# Altium schematic sheet SH2 - HBridge.SchDoc
size Letter
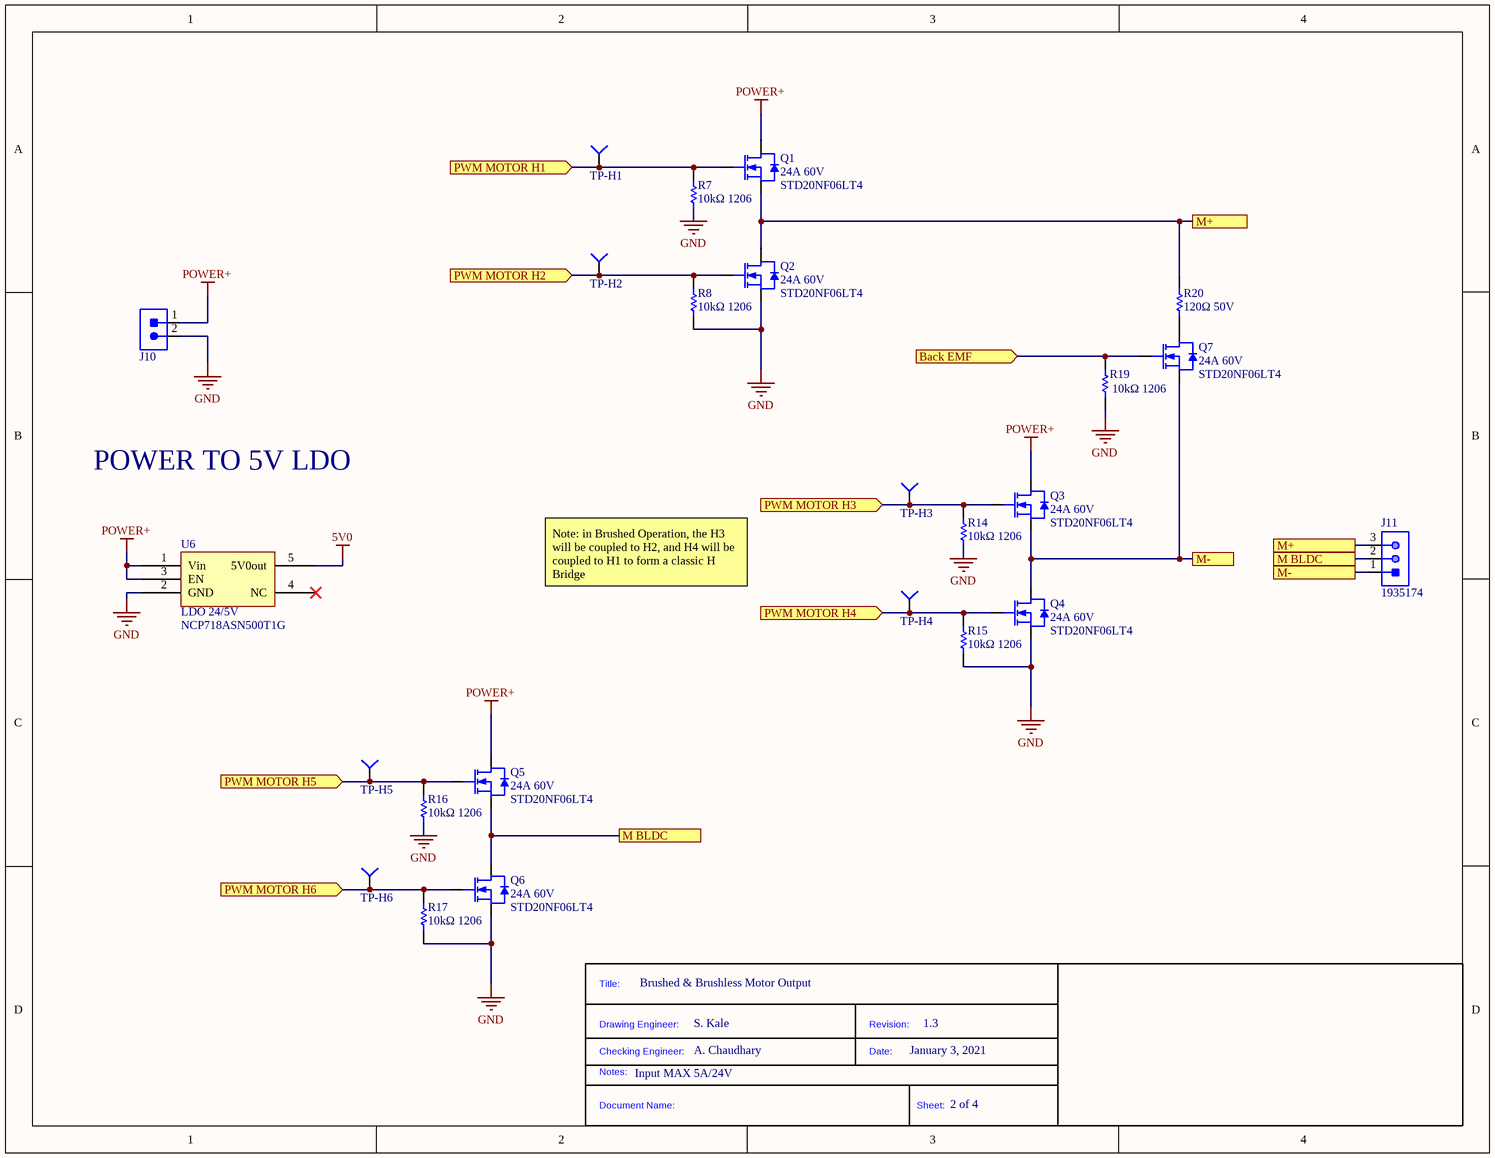
[diagram p0: SH2 - HBridge.SchDoc]

## Parts
*?  HORNET LOGO  (value not drawn)  (graphical)
?  TitleBlock  (value not drawn)  (graphical)
J10  CON 2-SCREW  [1935161]  (value not drawn)
J11  CON 3-SCREW  [1935174]  (value not drawn)
Q1  24A 60V  [STD20NF06LT4]
Q2  24A 60V  [STD20NF06LT4]
Q3  24A 60V  [STD20NF06LT4]
Q4  24A 60V  [STD20NF06LT4]
Q5  24A 60V  [STD20NF06LT4]
Q6  24A 60V  [STD20NF06LT4]
Q7  24A 60V  [STD20NF06LT4]
R7  10kΩ 1206  [13-RE1206FRE0710KLCT-ND]
R8  10kΩ 1206  [13-RE1206FRE0710KLCT-ND]
R14  10kΩ 1206  [13-RE1206FRE0710KLCT-ND]
R15  10kΩ 1206  [13-RE1206FRE0710KLCT-ND]
R16  10kΩ 1206  [13-RE1206FRE0710KLCT-ND]
R17  10kΩ 1206  [13-RE1206FRE0710KLCT-ND]
R19  10kΩ 1206  [13-RE1206FRE0710KLCT-ND]
R20  120Ω 50V  [SDR03EZPJ200]
TP-H1  TESTPT  [TESTPT SQUARE]  (value not drawn)
TP-H2  TESTPT  [TESTPT SQUARE]  (value not drawn)
TP-H3  TESTPT  [TESTPT SQUARE]  (value not drawn)
TP-H4  TESTPT  [TESTPT SQUARE]  (value not drawn)
TP-H5  TESTPT  [TESTPT SQUARE]  (value not drawn)
TP-H6  TESTPT  [TESTPT SQUARE]  (value not drawn)
U6  LDO 24/5V  [NCP718ASN500T1G]

## Ports
Back EMF (in), M BLDC, M+, M-, PWM MOTOR H1 (in), PWM MOTOR H2 (in), PWM MOTOR H3 (in), PWM MOTOR H4 (in), PWM MOTOR H5 (in), PWM MOTOR H6 (in)

## Nets
5V0: U6.5(5V0out)
GND: J10.2 Q2.3(Source) Q4.3(Source) Q6.3(Source) R7.1 R8.1 R14.1 R15.1 R16.1 R17.1 R19.1 U6.2(GND)
POWER+: J10.1 Q1.2(Drain) Q3.2(Drain) Q5.2(Drain) U6.1(Vin) U6.3(EN)
Back EMF: Q7.1(Gate) R19.2 ; port Back EMF
M BLDC: J11.2 Q5.3(Source) Q6.2(Drain) ; port M BLDC
M+: J11.3 Q1.3(Source) Q2.2(Drain) R20.2 ; port M+
M-: J11.1 Q3.3(Source) Q4.2(Drain) Q7.3(Source) ; port M-
PWM MOTOR H1: Q1.1(Gate) R7.2 TP-H1.1(=value) ; port PWM MOTOR H1
PWM MOTOR H2: Q2.1(Gate) R8.2 TP-H2.1(=value) ; port PWM MOTOR H2
PWM MOTOR H3: Q3.1(Gate) R14.2 TP-H3.1(=value) ; port PWM MOTOR H3
PWM MOTOR H4: Q4.1(Gate) R15.2 TP-H4.1(=value) ; port PWM MOTOR H4
PWM MOTOR H5: Q5.1(Gate) R16.2 TP-H5.1(=value) ; port PWM MOTOR H5
PWM MOTOR H6: Q6.1(Gate) R17.2 TP-H6.1(=value) ; port PWM MOTOR H6
NetQ7_2: Q7.2(Drain) R20.1

Not connected (* = marked no-connect by the designer): U6 4(NC)*

## Notes on the sheet
- POWER TO 5V LDO
- Note: in Brushed Operation, the H3 will be coupled to H2, and H4 will be coupled to H1 to form a classic H Bridge
- Brushed & Brushless Motor Output
- S. Kale
- 1.3
- Input MAX 5A/24V
- A. Chaudhary
- January 3, 2021
- 2 of 4
- (in symbol TitleBlock) Title:; Drawing Engineer:; Revision:; Checking Engineer:; Date:; Notes:; Document Name:; Sheet:

## Library data of the parts
? = TitleBlock: Standard Title Block
J10 = CON 2-SCREW: TERM BLK 2POS SIDE ENTRY 5MM; Manufacturer 1: Phoenix Contact; Package/Footprint: SMD; Supplier 1: Digi-Key; Mounting Type: TH; Supplier Part Number 1: 277-1667-ND; Manufacturer Part Number 1: 1935161
J11 = CON 3-SCREW: TERM BLK 3POS SIDE ENTRY 5MM; Manufacturer 1: Phoenix Contact; Package/Footprint: TH; Voltage Rating: 250V; Current Rating: 17.5A; Supplier 1: Digi-Key; Mounting Type: TH; Orientation: Straight; Pitch: 5mm; Supplier Part Number 1: 277-1578-ND; Manufacturer Part Number 1: 1935174
Q1-Q7 = MOSFET: Power Field-Effect Transistor, 24A I(D), 60V, 0.05ohm, 1-Element, N-Channel, Silicon, Metal-oxide Semiconductor FET, TO-252AA; Manufacturer: STMicroelectronics; Package Body Material: Plastic; Avalanche Energy Rating (Eas): 225mJ; Drain-source On Resistance-Max: 50mR; Number of Elements: 1; Operating Mode: ENHANCEMENT MODE; Power Dissipation-Max (Abs): 60W; Pulsed Drain Current-Max (IDM): 96A; Time @ Peak Reflow Temperature-Max (s): 30s; Transistor Application: SWITCHING; Qualification Status: Not Qualified; Supplier 1: Digi-Key; Manufacturer Part Number: STD20NF06LT4; RoHS: Yes; Category: MOSFETs; Stock 1: 17979; Pricing 1: 1=0.99000, 10=0.81000, 25=0.79520, 100=0.63000, 500=0.53400, 1000=0.43500 (USD); Number of Pins: 2; Package Shape: Rectangular; Terminal Finish: Tin; Transistor Element Material: SILICON; Max Operating Temperature: 175°C; JESD-609 Code: e3; Polarity/Channel Type: N-CHANNEL; Drain Current-Max (Abs) (ID): 24A; Drain Current-Max (ID): 24A; DS Breakdown Voltage-Min: 60V; FET Technology: METAL-OXIDE SEMICONDUCTOR; JESD-30 Code: R-PSSO-G2; Moisture Sensitivity Level: 1; Package Style: SMALL OUTLINEMeter; Peak Reflow Temperature (Cel): 260°C; Surface Mount: Yes; Terminal Form: Gull Wing; Terminal Position: SINGLE; JEDEC-95 Code: TO-252AA; ComponentLink1URL: https://datasheet.ciiva.com:443/pdfs/VipMasterIC/IC/SGST/SGSTS16849/SGSTS16849-1.pdf?src-supplier=IHS+Markit; ComponentLink1Description: https://datasheet.ciiva.com:443/pdfs/VipMasterIC/IC/SGST/SGSTS16849/SGSTS16849-1.pdf?src-supplier=IHS+Markit; ComponentLink2URL: https://datasheet.ciiva.com/5774/129580-5774199.pdf?src-supplier=Farnell; ComponentLink2Description: https://datasheet.ciiva.com/5774/129580-5774199.pdf?src-supplier=Farnell; ComponentLink3URL: https://datasheet.ciiva.com/4442/cd00003407-43085-4442056.pdf?src-supplier=Mouser; ComponentLink3Description: https://datasheet.ciiva.com/4442/cd00003407-43085-4442056.pdf?src-supplier=Mouser; ComponentLink4URL: https://datasheet.ciiva.com/25625/0900766b810e88d3-25625611.pdf?src-supplier=RSComponents; ComponentLink4Description: https://datasheet.ciiva.com/25625/0900766b810e88d3-25625611.pdf?src-supplier=RSComponents; ComponentLink5URL: https://datasheet.ciiva.com/46451/1398479-46451621.pdf?src-supplier=Jameco; ComponentLink5Description: https://datasheet.ciiva.com/46451/1398479-46451621.pdf?src-supplier=Jameco; ComponentLink6URL: https://datasheet.ciiva.com/16220/cd00003407-16220218.pdf?src-supplier=Future+Electronics; ComponentLink6Description: https://datasheet.ciiva.com/16220/cd00003407-16220218.pdf?src-supplier=Future+Electronics; ComponentLink7URL: https://datasheet.ciiva.com/17320/cd00003407-17320843.pdf?src-supplier=Avnet+Europe; ComponentLink7Description: https://datasheet.ciiva.com/17320/cd00003407-17320843.pdf?src-supplier=Avnet+Europe; ComponentLink8URL: https://datasheet.ciiva.com/937/cd00003407-937437.pdf?src-supplier=Digi-Key; ComponentLink8Description: https://datasheet.ciiva.com/937/cd00003407-937437.pdf?src-supplier=Digi-Key; ComponentLink9URL: https://datasheet.ciiva.com/937/cd00003407-937438.pdf?src-supplier=Digi-Key; ComponentLink9Description: https://datasheet.ciiva.com/937/cd00003407-937438.pdf?src-supplier=Digi-Key; ComponentLink10URL: https://datasheet.ciiva.com/937/cd00003407-937439.pdf?src-supplier=Digi-Key; ComponentLink10Description: https://datasheet.ciiva.com/937/cd00003407-937439.pdf?src-supplier=Digi-Key; Supplier Part Number 1: 497-5888-1-ND
R7 R8 R14-R17 R19 = RES 10k Ω: Fixed Resistor, Metal Glaze/thick Film, 0.25W, 10000ohm, 200V, 1% +/-Tol, 50ppm/Cel, Surface Mount, 1206; Manufacturer: Yageo; Manufacturer Part Number: RE1206FRE0710KL; Supplier 1: Digi-Key; RoHS: Yes; Category: Chip SMD Resistors; Stock 1: 6708; Pricing 1: 1=0.10000, 10=0.05900, 100=0.02390, 1000=0.01073, 2500=0.00932 (USD); ComponentLink1URL: https://datasheet.ciiva.com:443/pdfs/VipMasterIC/IC/YAGO/YAGO-S-A0003975721/YAGO-S-A0003975721-1.pdf?src-supplier=IHS+Markit; ComponentLink1Description: https://datasheet.ciiva.com:443/pdfs/VipMasterIC/IC/YAGO/YAGO-S-A0003975721/YAGO-S-A0003975721-1.pdf?src-supplier=IHS+Markit; ComponentLink2URL: http://www.yageo.com/NewPortal/yageodocoutput?fileName=/pdf/R-Chip/PYu-RE_105_RoHS_L_4.pdf&src-supplier=Digi-Key; ComponentLink2Description: http://www.yageo.com/NewPortal/yageodocoutput?fileName=/pdf/R-Chip/PYu-RE_105_RoHS_L_4.pdf&src-supplier=Digi-Key; Supplier Part Number 1: 13-RE1206FRE0710KLCT-ND
R20 = RES 120: Fixed Resistor, 0.1W, 120ohm, 50V, 5% +/-Tol, 200ppm/Cel, Surface Mount, 0603; Manufacturer: Rohm; Manufacturer Part Number: SDR03EZPJ121; Supplier 1: Digi-Key; RoHS: No; Category: Chip SMD Resistors; Stock 1: 4798; Pricing 1: 1=0.10000, 10=0.07300, 100=0.02800, 1000=0.01232, 2500=0.01064 (USD); ComponentLink1URL: https://datasheet.ciiva.com:443/pdfs/VipMasterIC/IC/ROHM/ROHM-S-A0002832543/ROHM-S-A0002832543-1.pdf?src-supplier=IHS+Markit; ComponentLink1Description: https://datasheet.ciiva.com:443/pdfs/VipMasterIC/IC/ROHM/ROHM-S-A0002832543/ROHM-S-A0002832543-1.pdf?src-supplier=IHS+Markit; ComponentLink2URL: https://www.rohm.com/datasheet/SDR03EZPJ/sdr-e?src-supplier=Digi-Key; ComponentLink2Description: https://www.rohm.com/datasheet/SDR03EZPJ/sdr-e?src-supplier=Digi-Key; Supplier Part Number 1: 511-1735-1-ND
TP-H1-TP-H6 = TESTPT SQUARE
U6 = LDO 24/5V: Fixed Positive LDO Regulator, 5V, 0.38V Dropout, PDSO5; Manufacturer: ON Semiconductor; Regulator Type: FIXED POSITIVE SINGLE OUTPUT LDO REGULATOR; Supplier 1: Digi-Key; RoHS: No; Category: Voltage Regulators - Linear; Stock 1: 3776; Pricing 1: 1=0.39000, 10=0.33800, 25=0.31520, 100=0.23400, 250=0.19800, 500=0.18900, 1000=0.13950 (USD); ComponentLink1URL: https://datasheet.ciiva.com:443/pdfs/VipMasterIC/IC/ONSM/ONSM-S-A0008936508/ONSM-S-A0008936508-1.pdf?src-supplier=IHS+Markit; ComponentLink1Description: https://datasheet.ciiva.com:443/pdfs/VipMasterIC/IC/ONSM/ONSM-S-A0008936508/ONSM-S-A0008936508-1.pdf?src-supplier=IHS+Markit; ComponentLink2URL: http://www.farnell.com/datasheets/2711392.pdf?src-supplier=Farnell; ComponentLink2Description: http://www.farnell.com/datasheets/2711392.pdf?src-supplier=Farnell; ComponentLink3URL: https://www.onsemi.com/pub/Collateral/NCP718-D.PDF?src-supplier=Digi-Key; ComponentLink3Description: https://www.onsemi.com/pub/Collateral/NCP718-D.PDF?src-supplier=Digi-Key; ComponentLink4URL: http://www.farnell.com/datasheets/2711392.pdf?src-supplier=Newark; ComponentLink4Description: http://www.farnell.com/datasheets/2711392.pdf?src-supplier=Newark; Supplier Part Number 1: NCP718ASN500T1GOSCT-ND; Manufacturer Part Number: NCP718ASN500T1G